# Altium schematic sheet Motor_Control.SchDoc
size Tabloid
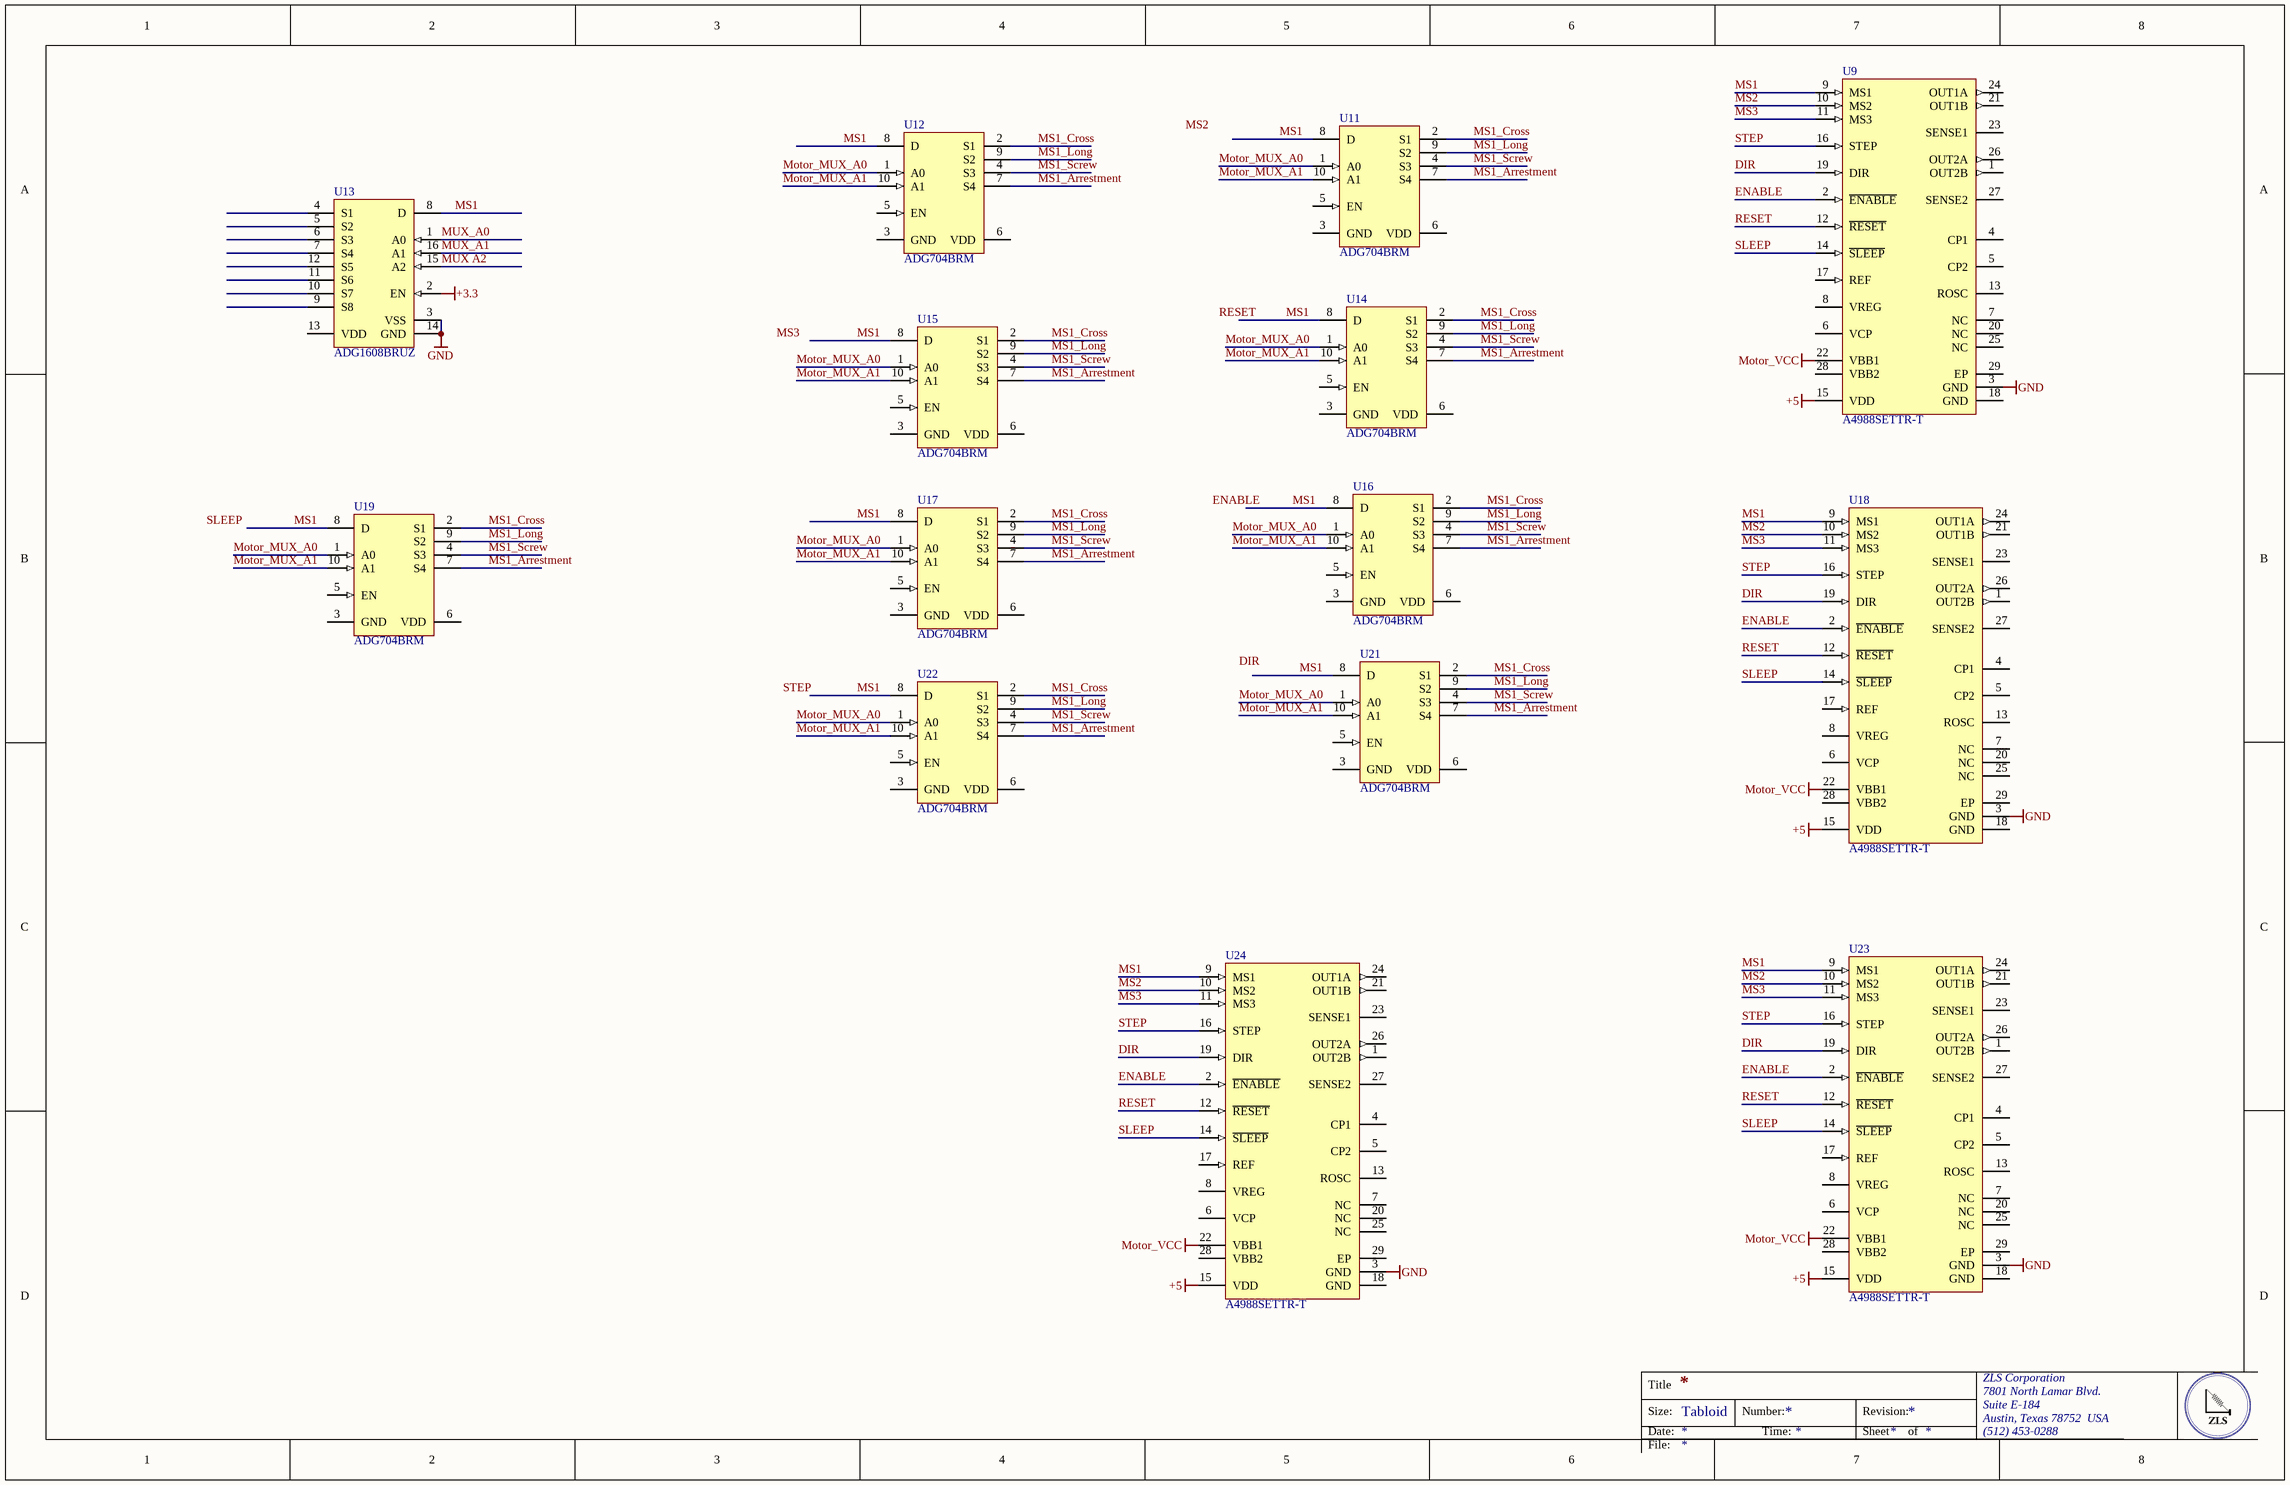
[diagram p0: Motor_Control.SchDoc]

## Parts
U9  A4988SETTR-T  [ALEG-ET-28_V]
U11  ADG704BRM  [ADI-RM-10_N]
U12  ADG704BRM  [ADI-RM-10_N]
U13  ADG1608BRUZ  [ADI-RU-16_M]
U14  ADG704BRM  [ADI-RM-10_N]
U15  ADG704BRM  [ADI-RM-10_N]
U16  ADG704BRM  [ADI-RM-10_N]
U17  ADG704BRM  [ADI-RM-10_N]
U18  A4988SETTR-T  [ALEG-ET-28_V]
U19  ADG704BRM  [ADI-RM-10_N]
U21  ADG704BRM  [ADI-RM-10_N]
U22  ADG704BRM  [ADI-RM-10_N]
U23  A4988SETTR-T  [ALEG-ET-28_V]
U24  A4988SETTR-T  [ALEG-ET-28_V]

## Nets
+3.3: U13.2(EN)
+5: U9.15(VDD) U18.15(VDD) U23.15(VDD) U24.15(VDD)
GND: U9.3(GND) U13.3(VSS) U13.14(GND) U18.3(GND) U23.3(GND) U24.3(GND)
Motor_VCC: U9.22(VBB1) U18.22(VBB1) U23.22(VBB1) U24.22(VBB1)
DIR: U9.19(DIR) U18.19(DIR) U23.19(DIR) U24.19(DIR)
ENABLE: U9.2(~{ENABLE}) U18.2(~{ENABLE}) U23.2(~{ENABLE}) U24.2(~{ENABLE})
Motor_MUX_A0: U11.1(A0) U12.1(A0) U14.1(A0) U15.1(A0) U16.1(A0) U17.1(A0) U19.1(A0) U21.1(A0) U22.1(A0)
Motor_MUX_A1: U11.10(A1) U12.10(A1) U14.10(A1) U15.10(A1) U16.10(A1) U17.10(A1) U19.10(A1) U21.10(A1) U22.10(A1)
MS1: U9.9(MS1) U11.8(D) U12.8(D) U13.8(D) U14.8(D) U15.8(D) U16.8(D) U17.8(D) U18.9(MS1) U19.8(D) U21.8(D) U22.8(D) U23.9(MS1) U24.9(MS1)
MS1_Arrestment: U11.7(S4) U12.7(S4) U14.7(S4) U15.7(S4) U16.7(S4) U17.7(S4) U19.7(S4) U21.7(S4) U22.7(S4)
MS1_Cross: U11.2(S1) U12.2(S1) U14.2(S1) U15.2(S1) U16.2(S1) U17.2(S1) U19.2(S1) U21.2(S1) U22.2(S1)
MS1_Long: U11.9(S2) U12.9(S2) U14.9(S2) U15.9(S2) U16.9(S2) U17.9(S2) U19.9(S2) U21.9(S2) U22.9(S2)
MS1_Screw: U11.4(S3) U12.4(S3) U14.4(S3) U15.4(S3) U16.4(S3) U17.4(S3) U19.4(S3) U21.4(S3) U22.4(S3)
MS2: U9.10(MS2) U18.10(MS2) U23.10(MS2) U24.10(MS2)
MS3: U9.11(MS3) U18.11(MS3) U23.11(MS3) U24.11(MS3)
MUX A2: U13.15(A2)
MUX_A0: U13.1(A0)
MUX_A1: U13.16(A1)
RESET: U9.12(~{RESET}) U18.12(~{RESET}) U23.12(~{RESET}) U24.12(~{RESET})
SLEEP: U9.14(~{SLEEP}) U18.14(~{SLEEP}) U23.14(~{SLEEP}) U24.14(~{SLEEP})
STEP: U9.16(STEP) U18.16(STEP) U23.16(STEP) U24.16(STEP)

Not connected (* = marked no-connect by the designer): U9 1(OUT2B) 4(CP1) 5(CP2) 6(VCP) 7(NC) 8(VREG) 13(ROSC) 17(REF) 18(GND) 20(NC) 21(OUT1B) 23(SENSE1) 24(OUT1A) 25(NC) 26(OUT2A) 27(SENSE2) 28(VBB2) 29(EP); U11 3(GND) 5(EN) 6(VDD); U12 3(GND) 5(EN) 6(VDD); U13 4(S1) 5(S2) 6(S3) 7(S4) 9(S8) 10(S7) 11(S6) 12(S5) 13(VDD); U14 3(GND) 5(EN) 6(VDD); U15 3(GND) 5(EN) 6(VDD); U16 3(GND) 5(EN) 6(VDD); U17 3(GND) 5(EN) 6(VDD); U18 1(OUT2B) 4(CP1) 5(CP2) 6(VCP) 7(NC) 8(VREG) 13(ROSC) 17(REF) 18(GND) 20(NC) 21(OUT1B) 23(SENSE1) 24(OUT1A) 25(NC) 26(OUT2A) 27(SENSE2) 28(VBB2) 29(EP); U19 3(GND) 5(EN) 6(VDD); U21 3(GND) 5(EN) 6(VDD); U22 3(GND) 5(EN) 6(VDD); U23 1(OUT2B) 4(CP1) 5(CP2) 6(VCP) 7(NC) 8(VREG) 13(ROSC) 17(REF) 18(GND) 20(NC) 21(OUT1B) 23(SENSE1) 24(OUT1A) 25(NC) 26(OUT2A) 27(SENSE2) 28(VBB2) 29(EP); U24 1(OUT2B) 4(CP1) 5(CP2) 6(VCP) 7(NC) 8(VREG) 13(ROSC) 17(REF) 18(GND) 20(NC) 21(OUT1B) 23(SENSE1) 24(OUT1A) 25(NC) 26(OUT2A) 27(SENSE2) 28(VBB2) 29(EP)

## Notes on the sheet
- Labels drawn without touching a wire or pin: DIR, ENABLE, MS2, MS3, RESET, SLEEP, STEP
- Title
- Size:
- Date:
- Tabloid
- Number:
- Time:
- Revision:
- Sheet
- of
- ZLS Corporation
- 7801 North Lamar Blvd.
- Suite E-184
- Austin, Texas 78752  USA
- (512) 453-0288
- File:

## Library data of the parts
U9 U18 U23 U24 = CMP-1742-00003-1: DMOS Microstepping Driver with Translator and Overcurrent Protection, 3 to 5.5 V, -20 to 85 degC, 28-Pin QFN (ET), RoHS, Tape and Reel; Peak Reverse Current: 6 mA; Forward Voltage: 500 mV; Case\Package: SMA; Max Surge Current: 40 A; Forward Current: 1 A; RoHSCompliant: true; REACH SVHC: Unknown; Width: 2.79 mm; Length: 4.5 mm; Pins: 2; PackageReference: ET28; PackageDescription: 28-Pin Quad Flat No-lead Package, Body 5.15 x 5.15 mm, Pitch 0.5 mm; Height: 2.087 mm; Radiation Hardening: No; ComponentLink2Description: Datasheet; ComponentLink1Description: Manufacturer URL; Package Quantity: 1800; DatasheetVersion: Rev. 6, 01/2016; Max Operating Temperature: 125 degC; Min Operating Temperature: -65 degC; ComponentLink1URL: http://www.allegromicro.com/; Packaging: Tape and Reel; ComponentLink2URL: http://www.allegromicro.com/en/Products/Part_Numbers/4988/4988.pdf; Mount: Surface Mount
U11 U12 U14-U17 U19 U21 U22 = CMP-0798-00102-1: CMOS Low Voltage 4 Ohm, 4-Channel Multiplexer, -40 to 85 degC, 10-pin SOP (RM-10), Tube; Manufacturer: Analog Devices; Bandwidth (Hz): 200M; Ron (ohms): 4; Max Analog Signal Range: 0 to Vdd; Supply V Guar Performance: Single_(+3.3V), Single_(+3V), Single_(+5V); DatasheetVersion: Rev. A; Mounting Technology: Surface Mount; PackageDescription: 10-Pin Mini Small Outline Package, Body 3 x 3 mm, Pitch 0.5 mm; Packing: Tube; ComponentLink1Description: Manufacturer URL; ComponentLink2URL: http://www.analog.com/static/imported-files/data_sheets/ADG704.pdf; ComponentLink3Description: Package Specification; PackageReference: RM-10; ComponentLink1URL: http://www.analog.com/en/index.html; ComponentLink2Description: Datasheet; PartNumber: ADG704BRM; Code_JEDEC: MO-187-BA; ComponentLink3URL: http://www.analog.com/static/imported-files/packages/PKG_PDF/MSOP%28RM%29/RM_10.pdf; PackageVersion: Aug-05
U13 = CMP-0793-00136-1: 4.5 Ohm Ron, 8-Channel +/-5 V,+12 V, +5 V and +3.3 V Multiplexer, 16-pin SOP (RU-16), Tube; Manufacturer: Analog Devices; Max Analog Signal Range: 0 to Vdd; Ron (ohms): 4.4; t transition (s): 150n; Bandwidth (Hz): 40M, 40M, 37M, 34M; Code_JEDEC: MO-153AB; PackageReference: RU-16; PackageDescription: 16-Pin Thin Shrink Small Outline Package, Body 5 x 4.4 mm, Pitch 0.65 mm; ComponentLink1Description: Manufacturer URL; ComponentLink2Description: Datasheet; PartNumber: ADG1608BRUZ; Mounting Technology: Surface Mount; PackageVersion: Nov-02; ComponentLink3Description: Package Specification; DatasheetVersion: Rev. 0; Packing: Tube; ComponentLink1URL: http://www.analog.com/en/index.html; ComponentLink3URL: http:/www.analog.com/static/imported-files/packages/36244347913743854010197452789RU16.pdf; ComponentLink2URL: http://www.analog.com/static/imported-files/data_sheets/ADG1608_1609.pdf